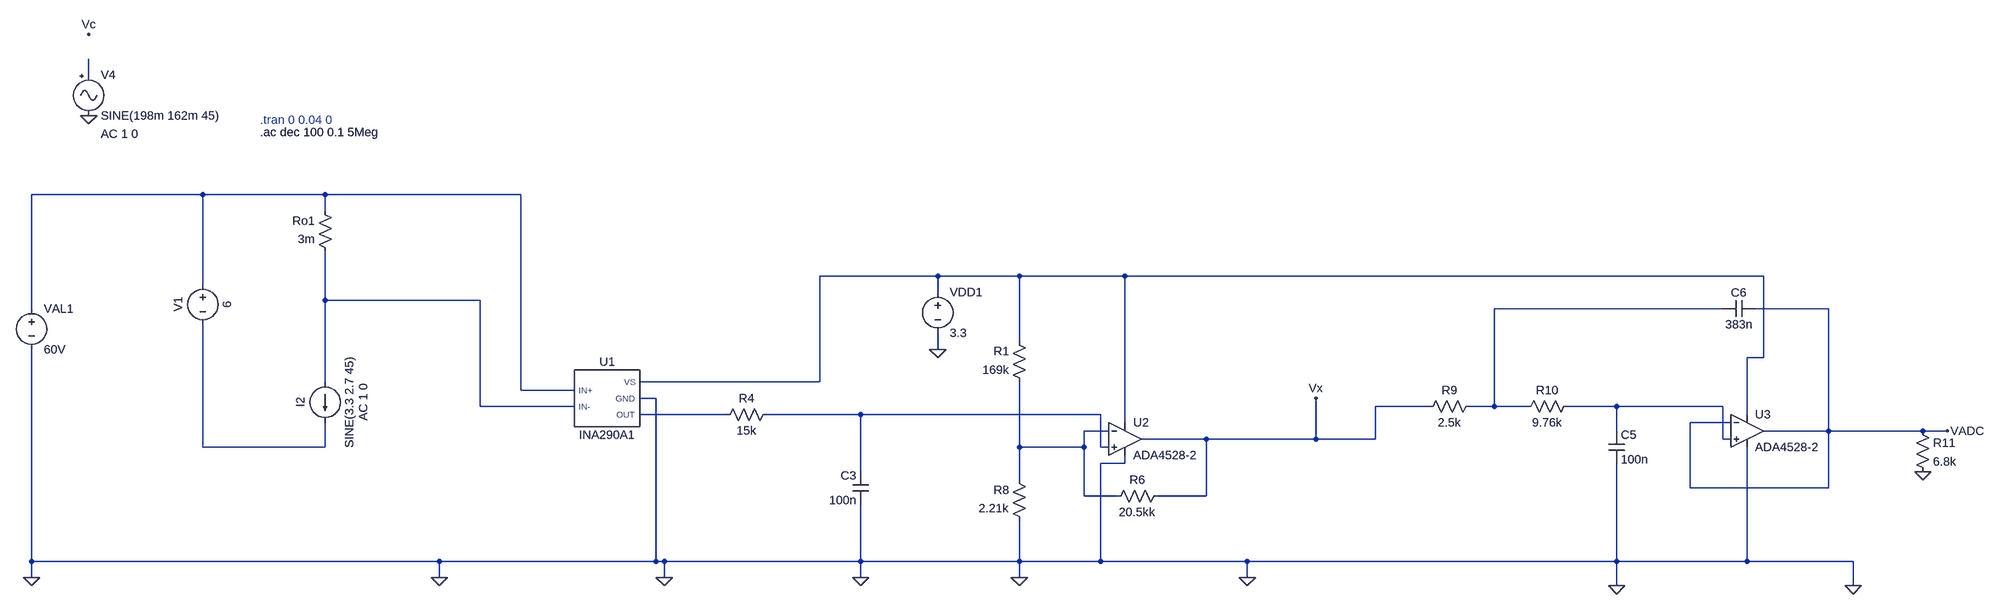
[diagram p0: schematic lab3.asc]
lab3.asc, the LTspice schematic file:
Version 4
SHEET 1 2964 3328
WIRE -1312 1920 -1312 1888
WIRE -1088 2368 -1424 2368
WIRE -848 2368 -1088 2368
WIRE -464 2368 -848 2368
WIRE -848 2400 -848 2368
WIRE 624 2528 336 2528
WIRE 784 2528 624 2528
WIRE 1008 2528 784 2528
WIRE 2384 2528 1008 2528
WIRE -1088 2544 -1088 2368
WIRE 624 2560 624 2528
WIRE -848 2576 -848 2480
WIRE -544 2576 -848 2576
WIRE -1424 2592 -1424 2368
WIRE 2304 2592 1856 2592
WIRE 2512 2592 2368 2592
WIRE 784 2656 784 2528
WIRE 624 2672 624 2640
WIRE 2384 2688 2384 2528
WIRE 2384 2688 2352 2688
WIRE -848 2736 -848 2576
WIRE 336 2736 336 2528
WIRE 336 2736 -64 2736
WIRE -464 2752 -464 2368
WIRE -192 2752 -464 2752
WIRE -32 2768 -64 2768
WIRE -544 2784 -544 2576
WIRE -192 2784 -544 2784
WIRE 1728 2784 1584 2784
WIRE 1856 2784 1856 2592
WIRE 1856 2784 1808 2784
WIRE 1920 2784 1856 2784
WIRE 2096 2784 2000 2784
WIRE 2304 2784 2096 2784
WIRE 112 2800 -64 2800
WIRE 416 2800 192 2800
WIRE 960 2800 416 2800
WIRE 2352 2800 2352 2688
WIRE 1008 2816 1008 2528
WIRE 2320 2816 2240 2816
WIRE 976 2832 928 2832
WIRE 2096 2832 2096 2784
WIRE 2512 2832 2512 2592
WIRE 2512 2832 2384 2832
WIRE 2720 2832 2512 2832
WIRE 2768 2832 2720 2832
WIRE 1168 2848 1040 2848
WIRE 1456 2848 1456 2768
WIRE 1456 2848 1168 2848
WIRE 1584 2848 1584 2784
WIRE 1584 2848 1456 2848
WIRE 2304 2848 2304 2784
WIRE 2320 2848 2304 2848
WIRE -1088 2864 -1088 2624
WIRE -848 2864 -848 2816
WIRE -848 2864 -1088 2864
WIRE 784 2864 784 2736
WIRE 928 2864 928 2832
WIRE 928 2864 784 2864
WIRE 960 2864 960 2800
WIRE 976 2864 960 2864
WIRE 1008 2896 1008 2880
WIRE 1008 2896 960 2896
WIRE 416 2912 416 2800
WIRE 784 2928 784 2864
WIRE 2240 2944 2240 2816
WIRE 2512 2944 2512 2832
WIRE 2512 2944 2240 2944
WIRE 928 2960 928 2864
WIRE 992 2960 928 2960
WIRE 1168 2960 1168 2848
WIRE 1168 2960 1072 2960
WIRE -1424 3088 -1424 2672
WIRE -624 3088 -1424 3088
WIRE -32 3088 -32 2768
WIRE -32 3088 -624 3088
WIRE -16 3088 -32 3088
WIRE 416 3088 416 2976
WIRE 416 3088 -16 3088
WIRE 784 3088 784 3008
WIRE 784 3088 416 3088
WIRE 960 3088 960 2896
WIRE 960 3088 784 3088
WIRE 1248 3088 960 3088
WIRE 2096 3088 2096 2896
WIRE 2096 3088 1248 3088
WIRE 2352 3088 2352 2864
WIRE 2352 3088 2096 3088
WIRE 2560 3088 2352 3088
WIRE -1424 3120 -1424 3088
WIRE -624 3120 -624 3088
WIRE -16 3120 -16 3088
WIRE 416 3120 416 3088
WIRE 784 3120 784 3088
WIRE 1248 3120 1248 3088
WIRE 2096 3136 2096 3088
WIRE 2560 3136 2560 3088
FLAG -1312 2000 0
FLAG -1312 1840 Vc
FLAG -1424 3120 0
FLAG -16 3120 0
FLAG 624 2672 0
FLAG 784 3120 0
FLAG 416 3120 0
FLAG -624 3120 0
FLAG 1248 3120 0
FLAG 1456 2768 Vx
FLAG 2560 3136 0
FLAG 2096 3136 0
FLAG 2768 2832 VADC
FLAG 2720 2912 0
DATAFLAG -848 2832 ""
SYMBOL Misc\\signal -1312 1904 R0
WINDOW 123 24 132 Left 2
WINDOW 39 0 0 Left 0
SYMATTR Value2 AC 1 0
SYMATTR InstName V4
SYMATTR Value SINE(198m 162m 45)
SYMBOL res -832 2496 R180
WINDOW 0 36 76 Left 2
WINDOW 3 36 40 Left 2
SYMATTR InstName Ro1
SYMATTR Value 3m
SYMBOL voltage -1424 2576 R0
WINDOW 123 0 0 Left 0
WINDOW 39 0 0 Left 0
SYMATTR InstName VAL1
SYMATTR Value 60V
SYMBOL current -848 2736 R0
WINDOW 0 -32 40 VBottom 2
WINDOW 3 32 40 VTop 2
WINDOW 123 60 40 VTop 2
WINDOW 39 0 0 Left 0
SYMATTR InstName I2
SYMATTR Value SINE(3.3 2.7 45)
SYMATTR Value2 AC 1 0
SYMBOL voltage -1088 2528 R0
WINDOW 0 -32 56 VBottom 2
WINDOW 3 32 56 VTop 2
WINDOW 123 0 0 Left 0
WINDOW 39 0 0 Left 0
SYMATTR InstName V1
SYMATTR Value 6
SYMBOL voltage 624 2544 R0
WINDOW 123 0 0 Left 0
WINDOW 39 0 0 Left 0
SYMATTR InstName VDD1
SYMATTR Value 3.3
SYMBOL res 1088 2944 R90
WINDOW 0 0 56 VBottom 2
WINDOW 3 32 56 VTop 2
SYMATTR InstName R6
SYMATTR Value 20.5kk
SYMBOL res 800 2752 R180
WINDOW 0 36 76 Left 2
WINDOW 3 36 40 Left 2
SYMATTR InstName R1
SYMATTR Value 169k
SYMBOL res 800 3024 R180
WINDOW 0 36 76 Left 2
WINDOW 3 36 40 Left 2
SYMATTR InstName R8
SYMATTR Value 2.21k
SYMBOL cap 432 2976 R180
WINDOW 0 24 56 Left 2
WINDOW 3 24 8 Left 2
SYMATTR InstName C3
SYMATTR Value 100n
SYMBOL res 1824 2768 R90
WINDOW 0 0 56 VBottom 2
WINDOW 3 32 56 VTop 2
SYMATTR InstName R9
SYMATTR Value 2.5k
SYMBOL res 2016 2768 R90
WINDOW 0 0 56 VBottom 2
WINDOW 3 32 56 VTop 2
SYMATTR InstName R10
SYMATTR Value 9.76k
SYMBOL cap 2080 2832 R0
SYMATTR InstName C5
SYMATTR Value 100n
SYMBOL cap 2368 2576 R90
WINDOW 0 0 32 VBottom 2
WINDOW 3 32 32 VTop 2
SYMATTR InstName C6
SYMATTR Value 383n
SYMBOL res 2704 2816 R0
SYMATTR InstName R11
SYMATTR Value 6.8k
SYMBOL res 208 2784 R90
WINDOW 0 0 56 VBottom 2
WINDOW 3 32 56 VTop 2
SYMATTR InstName R4
SYMATTR Value 15k
SYMBOL INA290A1 -128 2768 R0
SYMATTR InstName U1
SYMBOL OpAmps\\ADA4528-2 1008 2784 R0
SYMATTR InstName U2
SYMBOL OpAmps\\ADA4528-2 2352 2768 R0
SYMATTR InstName U3
TEXT -976 2008 Left 2 ;.tran 0 0.04 0
TEXT -976 2032 Left 2 !.ac dec 100 0.1 5Meg

The netlist it stands for:
* lab3.asc
V4 N001 0 SINE(198m 162m 45) AC 1 0
Ro1 N004 N002 3m
VAL1 N002 0 60V
I2 N004 N010 SINE(3.3 2.7 45) AC 1 0
V1 N002 N010 6
VDD1 N003 0 3.3
R6 Vx N009 20.5kk
R1 N009 N003 169k
R8 0 N009 2.21k
C3 0 N008 100n
R9 N005 Vx 2.5k
R10 N006 N005 9.76k
C5 N006 0 100n
C6 VADC N005 383n
R11 VADC 0 6.8k
R4 N008 N007 15k
XU1 N002 N004 N003 0 N007 INA290A1  ; pins IN+ IN- VS GND OUT
XU2 N008 N009 N003 0 Vx ADA4528-2  ; pins In+ In- V+ V- OUT
XU3 N006 VADC N003 0 VADC ADA4528-2  ; pins In+ In- V+ V- OUT
* .tran 0 0.04 0
.ac dec 100 0.1 5Meg
.lib C:\Users\skipi\Desktop\Leo\PoliTo\Anno4\Semestre2\ANALabs\LAB3\INA290A1.lib
.backanno
.end